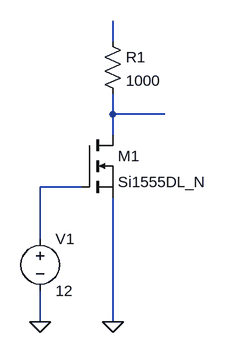
[diagram p0: schematic 0.5.asc]
0.5.asc, the LTspice schematic file:
Version 4
SHEET 1 2928 1060
WIRE 2608 608 2608 576
WIRE 2608 720 2608 688
WIRE 2688 720 2608 720
WIRE 2608 752 2608 720
WIRE 2560 832 2496 832
WIRE 2496 912 2496 832
WIRE 2496 1040 2496 992
WIRE 2608 1040 2608 848
FLAG 2496 1040 0
FLAG 2608 1040 0
SYMBOL voltage 2496 896 R0
WINDOW 123 0 0 Left 2
WINDOW 39 0 0 Left 2
SYMATTR InstName V1
SYMATTR Value 12
SYMBOL nmos 2560 752 R0
SYMATTR InstName M1
SYMATTR Value Si1555DL_N
SYMBOL res 2592 592 R0
SYMATTR InstName R1
SYMATTR Value 1000

The netlist it stands for:
* 0.5.asc
V1 N003 0 12
M1 N002 N003 0 0 Si1555DL_N
R1 N001 N002 1000
.model NMOS NMOS
.model PMOS PMOS
.lib standard.mos
.backanno
.end